# Altium project SecurityTerminalV1.3.PrjPCB
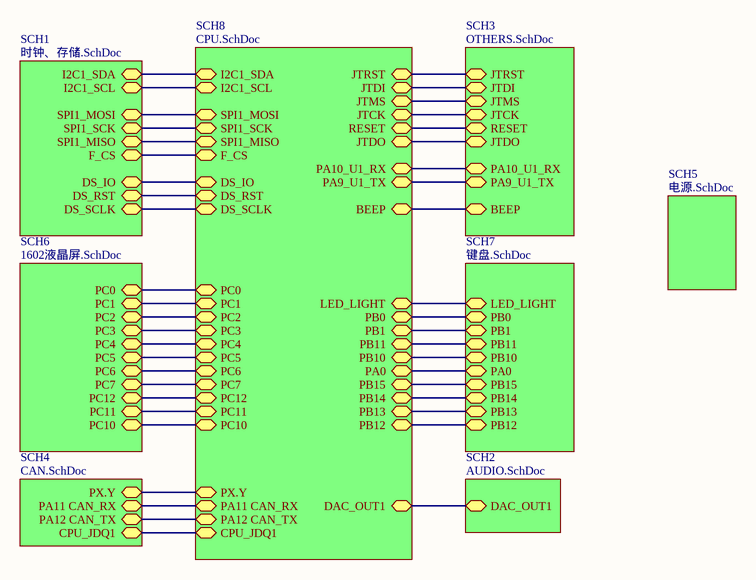
[diagram p0: PCB1.SchDoc]
4 sheets, 39 parts. Net scope: hierarchical (ports join the sheet entries above them; power ports are global).
Sheets:
  PCB1.SchDoc
    SCH2 = AUDIO.SchDoc
    SCH5 = 电源.SchDoc
    SCH7 = 键盘.SchDoc

## Sheet PCB1.SchDoc
size A4

### Sub-sheets
SCH1 = 时钟、存储.SchDoc (file not in this document): DS_SCLK, DS_RST, DS_IO, F_CS, SPI1_MISO, SPI1_SCK, SPI1_MOSI, I2C1_SCL, I2C1_SDA
SCH2 = AUDIO.SchDoc: DAC_OUT1
SCH3 = OTHERS.SchDoc (file not in this document): JTRST, JTDI, JTMS, JTCK, RESET, JTDO, PA10_U1_RX, PA9_U1_TX, BEEP
SCH4 = CAN.SchDoc (file not in this document): PX.Y, PA11 CAN_RX, PA12 CAN_TX, CPU_JDQ1
SCH5 = 电源.SchDoc: no entries
SCH6 = 1602液晶屏.SchDoc (file not in this document): PC10, PC11, PC12, PC7, PC6, PC5, PC4, PC3, PC2, PC1, PC0
SCH7 = 键盘.SchDoc: LED_LIGHT, PB0, PB1, PB11, PB10, PA0, PB15, PB14, PB13, PB12
SCH8 = CPU.SchDoc (file not in this document): DS_SCLK, DS_RST, DS_IO, F_CS, SPI1_MISO, SPI1_SCK, SPI1_MOSI, I2C1_SCL, I2C1_SDA, DAC_OUT1, JTRST, JTDI, JTMS, JTCK, RESET, JTDO, BEEP, PA10_U1_RX, PA9_U1_TX, PC10, PC11, PC12, PC7, PC6, PC5, PC4, PC3, PC2, PC1, PC0, LED_LIGHT, PB0, PB1, PB11, PB10, PA0, PB15, PB14, PB13, PB12, PA11 CAN_RX, PA12 CAN_TX, PX.Y, CPU_JDQ1

### Nets
DAC_OUT1: sheet SCH2/DAC_OUT1, sheet SCH8/DAC_OUT1
LED_LIGHT: sheet SCH8/LED_LIGHT, sheet SCH7/LED_LIGHT
PA0: sheet SCH8/PA0, sheet SCH7/PA0
PB0: sheet SCH8/PB0, sheet SCH7/PB0
PB1: sheet SCH8/PB1, sheet SCH7/PB1
PB10: sheet SCH8/PB10, sheet SCH7/PB10
PB11: sheet SCH8/PB11, sheet SCH7/PB11
PB12: sheet SCH8/PB12, sheet SCH7/PB12
PB13: sheet SCH8/PB13, sheet SCH7/PB13
PB14: sheet SCH8/PB14, sheet SCH7/PB14
PB15: sheet SCH8/PB15, sheet SCH7/PB15
(unnamed): sheet SCH6/PC10, sheet SCH8/PC10
(unnamed): sheet SCH6/PC11, sheet SCH8/PC11
(unnamed): sheet SCH6/PC12, sheet SCH8/PC12
(unnamed): sheet SCH6/PC7, sheet SCH8/PC7
(unnamed): sheet SCH6/PC6, sheet SCH8/PC6
(unnamed): sheet SCH6/PC5, sheet SCH8/PC5
(unnamed): sheet SCH6/PC4, sheet SCH8/PC4
(unnamed): sheet SCH6/PC3, sheet SCH8/PC3
(unnamed): sheet SCH6/PC2, sheet SCH8/PC2
(unnamed): sheet SCH6/PC1, sheet SCH8/PC1
(unnamed): sheet SCH6/PC0, sheet SCH8/PC0
(unnamed): sheet SCH4/PX.Y, sheet SCH8/PX.Y
(unnamed): sheet SCH4/PA11 CAN_RX, sheet SCH8/PA11 CAN_RX
(unnamed): sheet SCH4/PA12 CAN_TX, sheet SCH8/PA12 CAN_TX
(unnamed): sheet SCH4/CPU_JDQ1, sheet SCH8/CPU_JDQ1
(unnamed): sheet SCH8/DS_SCLK, sheet SCH1/DS_SCLK
(unnamed): sheet SCH8/DS_RST, sheet SCH1/DS_RST
(unnamed): sheet SCH8/DS_IO, sheet SCH1/DS_IO
(unnamed): sheet SCH8/F_CS, sheet SCH1/F_CS
(unnamed): sheet SCH8/SPI1_MISO, sheet SCH1/SPI1_MISO
(unnamed): sheet SCH8/SPI1_SCK, sheet SCH1/SPI1_SCK
(unnamed): sheet SCH8/SPI1_MOSI, sheet SCH1/SPI1_MOSI
(unnamed): sheet SCH8/I2C1_SCL, sheet SCH1/I2C1_SCL
(unnamed): sheet SCH8/I2C1_SDA, sheet SCH1/I2C1_SDA
(unnamed): sheet SCH8/JTRST, sheet SCH3/JTRST
(unnamed): sheet SCH8/JTDI, sheet SCH3/JTDI
(unnamed): sheet SCH8/JTMS, sheet SCH3/JTMS
(unnamed): sheet SCH8/JTCK, sheet SCH3/JTCK
(unnamed): sheet SCH8/RESET, sheet SCH3/RESET
(unnamed): sheet SCH8/JTDO, sheet SCH3/JTDO
(unnamed): sheet SCH8/BEEP, sheet SCH3/BEEP
(unnamed): sheet SCH8/PA10_U1_RX, sheet SCH3/PA10_U1_RX
(unnamed): sheet SCH8/PA9_U1_TX, sheet SCH3/PA9_U1_TX

## Sheet AUDIO.SchDoc
size A4
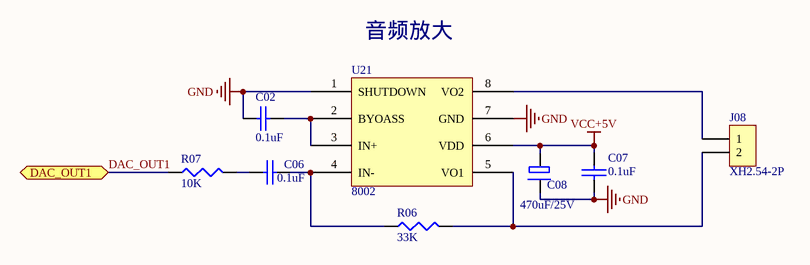
[diagram p1: AUDIO.SchDoc]

### Parts
C02  0.1uF  [0603]
C06  0.1uF  [0603]
C07  0.1uF  [0603]
C08  470uF/25V  [RB3.5-W]
J08  XH2.54-2P  [2.54]
R06  33K  [0603]
R07  10K  [0603]
U21  8002  [SO-8]

### Ports
DAC_OUT1

### Nets
GND: C02.2 C07.1 C08.2 U21.1(SHUTDOWN) U21.7(GND)
VCC+5V: C07.2 C08.1 U21.6(VDD)
DAC_OUT1: R07.1 ; port DAC_OUT1
NetC02_1: C02.1 U21.2(BYOASS) U21.3(IN+)
NetC06_1: C06.1 R06.1 U21.4(IN-)
NetC06_2: C06.2 R07.2
NetJ08_1: J08.1 U21.8(VO2)
NetJ08_2: J08.2 R06.2 U21.5(VO1)

### Notes on the sheet
- (near U21) 音频放大

### Library data of the parts
C02 C06 C07 = CAP-0603: 0603陶瓷贴片电容
C08 = 470uF/25V: 470uF/25V电解电容
J08 = XH2.54-2P: XH2.54-2A
R06 R07 = RES-0603: 陶瓷贴片电阻0603封装
U21 = 8002: 音频功放IC

## Sheet 电源.SchDoc
size A4
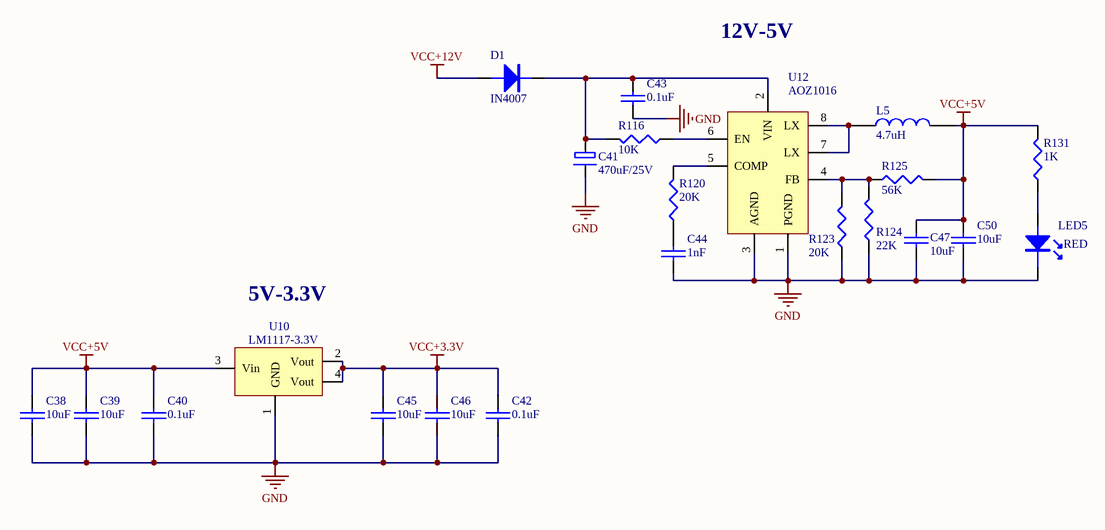
[diagram p2: 电源.SchDoc]

### Parts
C38  10uF  [0805]
C39  10uF  [0805]
C40  0.1uF  [0603]
C41  470uF/25V  [RB3.5]
C42  0.1uF  [0603]
C43  0.1uF  [0603]
C44  1nF  [0603]
C45  10uF  [0805]
C46  10uF  [0805]
C47  10uF  [0805]
C50  10uF  [0805]
D1  IN4007  [SMA(DO-214AC)]
L5  4.7uH  [INDUCTOR 7*7]
LED5  RED  [LED-0603]
R116  10K  [0603]
R120  20K  [0603]
R123  20K  [0603]
R124  22K  [0603]
R125  56K  [0603]
R131  1K  [0603]
U10  LM1117-3.3V  [SOT-223]
U12  AOZ1016  [SO-8]

### Nets
GND: C38.2 C39.2 C40.1 C41.2 C42.1 C43.1 C44.1 C45.2 C46.2 C47.1 C50.2 LED5.2 R123.1 R124.1 U10.1(GND) U12.1(PGND) U12.3(AGND)
VCC+3.3V: C42.2 C45.1 C46.1 U10.2(Vout) U10.4(Vout)
VCC+5V: C38.1 C39.1 C40.2 C47.2 C50.1 L5.2 R125.2 R131.2 U10.3(Vin)
VCC+12V: D1.1(A)
NetC41_1: C41.1 C43.2 D1.2(K) R116.2 U12.2(VIN)
NetC44_2: C44.2 R120.1
NetL5_1: L5.1 U12.7(LX) U12.8(LX)
NetLED5_1: LED5.1 R131.1
NetR116_1: R116.1 U12.6(EN)
NetR120_2: R120.2 U12.5(COMP)
NetR123_2: R123.2 R124.2 R125.1 U12.4(FB)

### Notes on the sheet
- 12V-5V
- 5V-3.3V

### Library data of the parts
C38 C39 C45-C47 C50 = CAP-0805: 0805陶瓷贴片电容
C40 C42-C44 = CAP-0603: 0603陶瓷贴片电容
C41 = 470uF/25V: 470uF/25V电解电容
D1 = IN4007: 整流二极管
L5 = INDUCTOR
LED5 = LED-0603: LED贴片发光二极管0603封装
R116 R120 R123-R125 R131 = RES-0603: 陶瓷贴片电阻0603封装
U12 = AOZ1016: DC-DC降压电源管理芯片

## Sheet 键盘.SchDoc
size A4
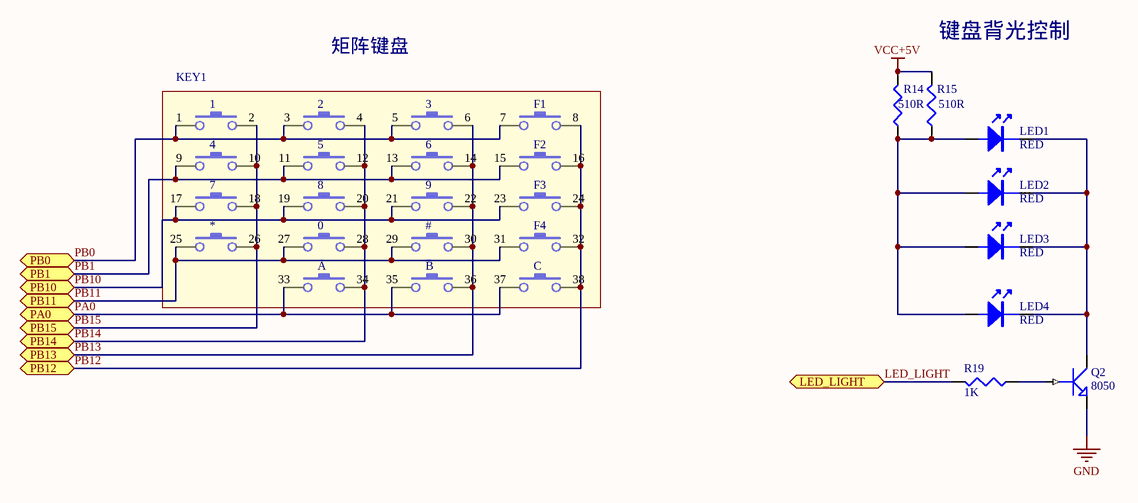
[diagram p3: 键盘.SchDoc]

### Parts
KEY1  SW-17  [KEY-17]  (value not drawn)
LED1  RED  [LED-0603]
LED2  RED  [LED-0603]
LED3  RED  [LED-0603]
LED4  RED  [LED-0603]
Q2  8050  [SOT-23]
R14  510R  [0603]
R15  510R  [0603]
R19  1K  [0603]

### Ports
LED_LIGHT, PA0, PB0, PB1, PB10, PB11, PB12, PB13, PB14, PB15

### Nets
GND: Q2.2(E)
VCC+5V: R14.2 R15.2
LED_LIGHT: R19.2 ; port LED_LIGHT
PA0: KEY1.33 KEY1.35 KEY1.37 ; port PA0
PB0: KEY1.1 KEY1.3 KEY1.5 KEY1.7 ; port PB0
PB1: KEY1.9 KEY1.11 KEY1.13 KEY1.15 ; port PB1
PB10: KEY1.17 KEY1.19 KEY1.21 KEY1.23 ; port PB10
PB11: KEY1.25 KEY1.27 KEY1.29 KEY1.31 ; port PB11
PB12: KEY1.8 KEY1.16 KEY1.24 KEY1.32 KEY1.38 ; port PB12
PB13: KEY1.6 KEY1.14 KEY1.22 KEY1.30 KEY1.36 ; port PB13
PB14: KEY1.4 KEY1.12 KEY1.20 KEY1.28 KEY1.34 ; port PB14
PB15: KEY1.2 KEY1.10 KEY1.18 KEY1.26 ; port PB15
NetLED1_1: LED1.1 LED2.1 LED3.1 LED4.1 R14.1 R15.1
NetLED1_2: LED1.2 LED2.2 LED3.2 LED4.2 Q2.3(C)
NetQ2_1: Q2.1(B) R19.1

### Notes on the sheet
- 矩阵键盘
- 键盘背光控制
- (near KEY1) 1
- (near KEY1) 4
- (near KEY1) 2
- (near KEY1) 5
- (near KEY1) 3
- (near KEY1) 6
- (near KEY1) F1
- (near KEY1) F2
- (near KEY1) 7
- (near KEY1) 8
- (near KEY1) 9
- (near KEY1) F3
- (near KEY1) *
- (near KEY1) 0
- (near KEY1) A
- (near KEY1) #
- (near KEY1) B
- (near KEY1) F4
- (near KEY1) C

### Library data of the parts
KEY1 = SW-17: 终端操作按键
LED1-LED4 = LED-0603: LED贴片发光二极管0603封装
Q2 = 8050: 8050 NPN型三极管
R14 R15 R19 = RES-0603: 陶瓷贴片电阻0603封装

## Nets that join several sheets
GND: AUDIO (5 pins), 电源 (17 pins), 键盘 (Q2.2)
VCC+5V: AUDIO (C07.2 C08.1 U21.6), 电源 (9 pins), 键盘 (R14.2 R15.2)